# EAGLE schematic TemperaturaMagnetron (EAGLE 6.1)
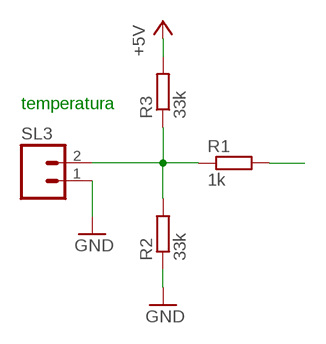
[diagram p0: schematic, sheet 1]

## Parts
R1  1k  R-EU_0204/7  [0204/7]
R2  33k  R-EU_0204/7  [0204/7]
R3  33k  R-EU_0204/7  [0204/7]
SL3  M02  [02P]

## Nets
+5V: R3.2
GND: R2.1 SL3.1
N$1: R1.1 R2.2 R3.1 SL3.2
N$65: R1.2

## Notes on the sheet
- temperatura

## Library data of the parts
R1-R3 = rcl:R-EU_: RESISTOR, European symbol
SL3 = con-amp-quick:M02: AMP QUICK CONNECTOR; OC_FARNELL: unknown; OC_NEWARK: unknown